# EAGLE design AST1035 (EAGLE 6.3)
DATABASE: ./../../../../../Components/TinyCircuits_Part_Database.txt
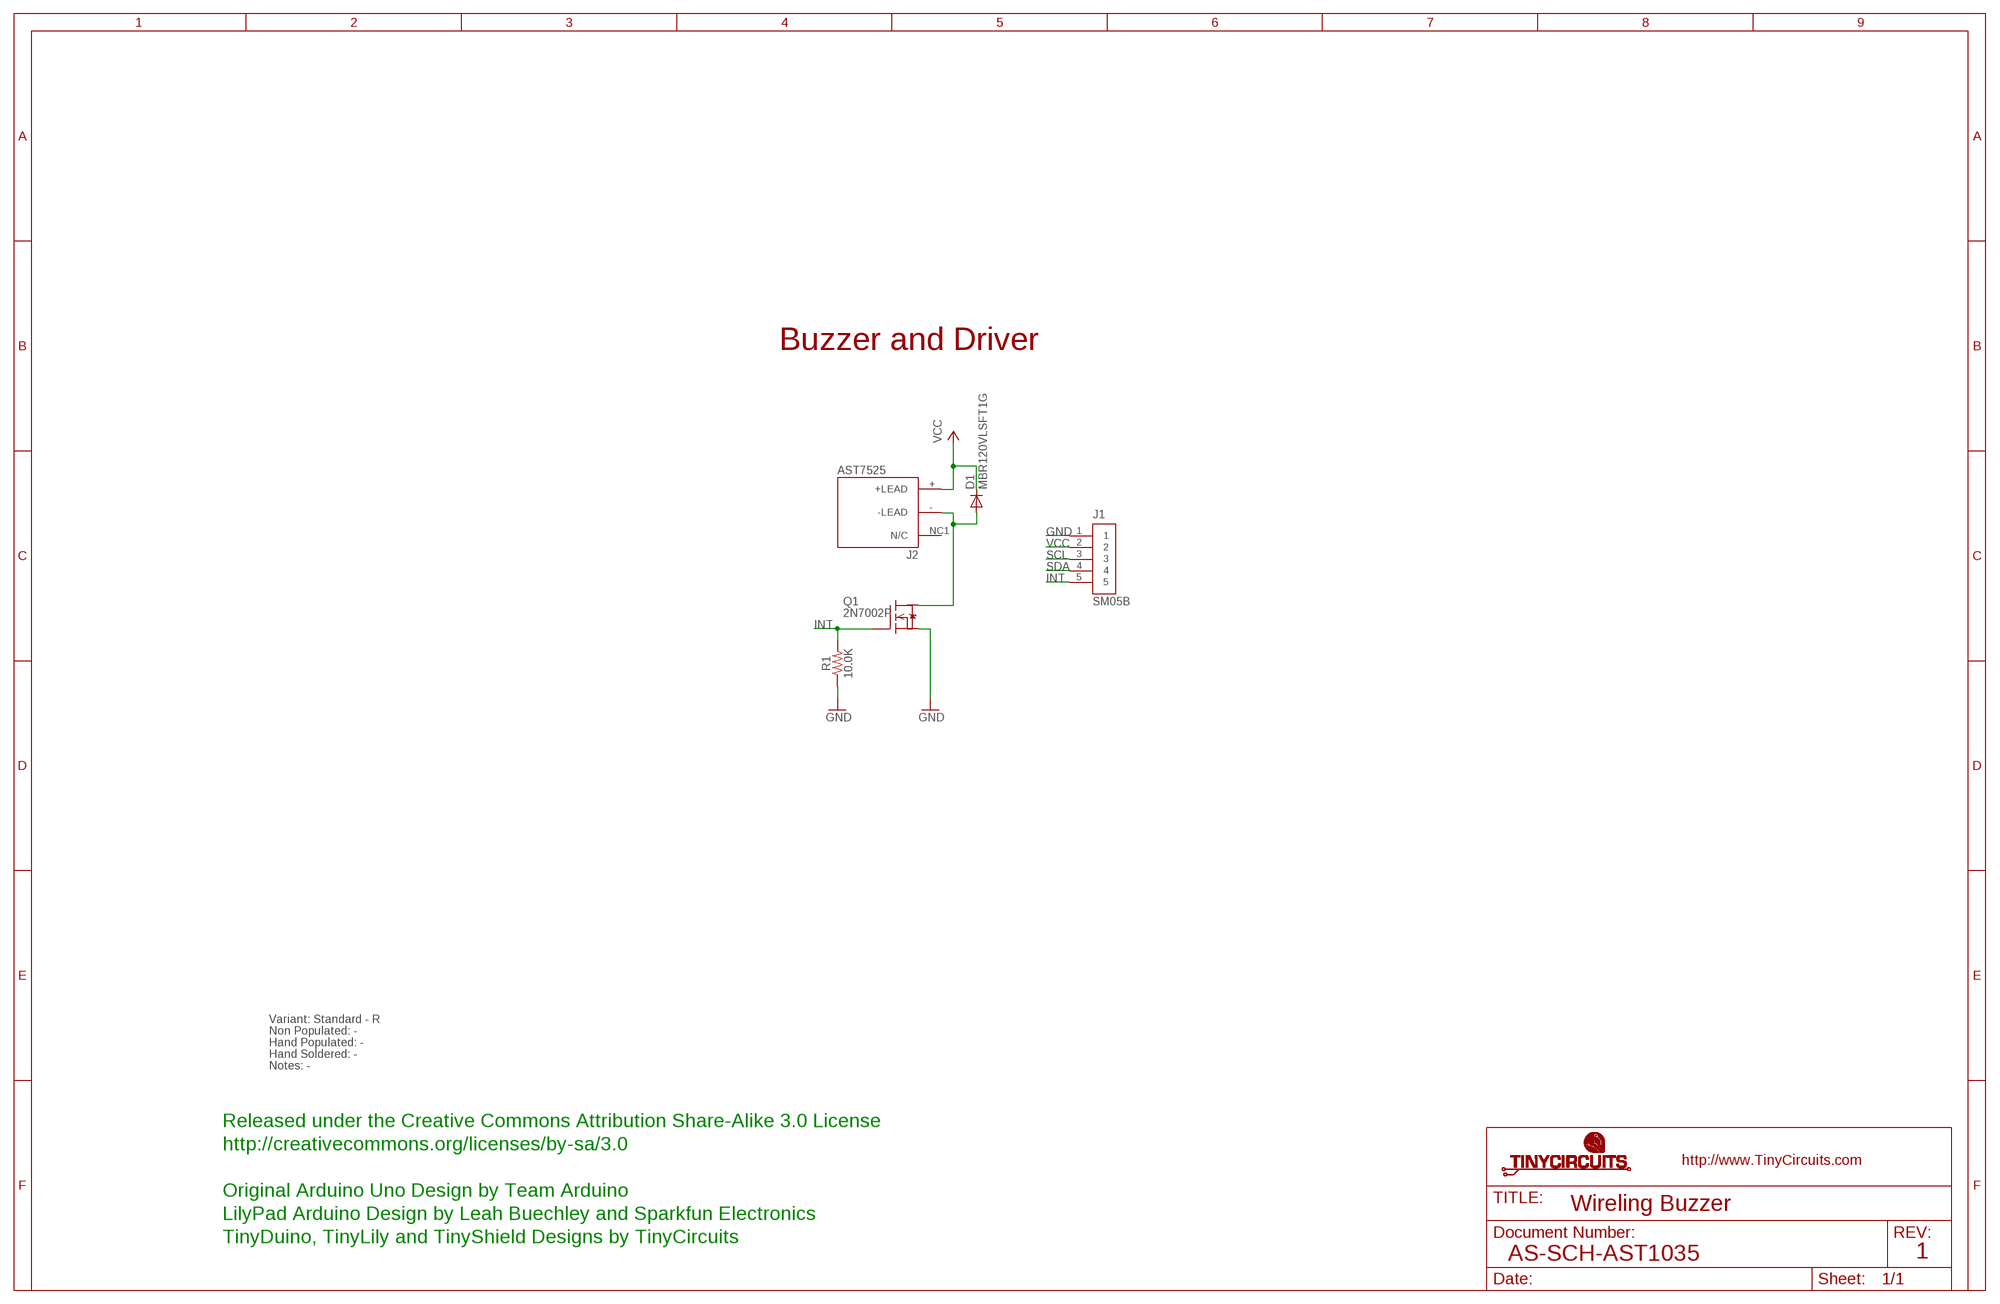
[diagram p0: schematic, sheet 1]

## Parts
D1  MBR120VLSFT1G  AS-ITM-00111  [SOD-123FL]
J1  SM05B  AS-ITM-00340EDGE  [JST_SH_5X1_EDGE]
J2  AST7525  AS-ITM-00390  [AST7525]
Q1  2N7002P  AS-ITM-00007C  [SOT23A]
R1  10.0K  AS-ITM-00032  [0402]

## Nets
GND: J1.1 Q1.E(S) R1.1
INT: J1.5 Q1.B(G) R1.2
LOAD: D1.A J2.-(-LEAD) Q1.C(D)
SCL: J1.3
SDA: J1.4
VCC: D1.C J1.2 J2.+(+LEAD)
Unconnected: J2.NC1(N/C)

## Notes on the sheet
- Buzzer and Driver
- Variant: Standard - R
- Non Populated: -
- Hand Populated: -
- Hand Soldered: -
- Notes: -
- Released under the Creative Commons Attribution Share-Alike 3.0 License
- http://creativecommons.org/licenses/by-sa/3.0
- Original Arduino Uno Design by Team Arduino
- Wireling Buzzer
- LilyPad Arduino Design by Leah Buechley and Sparkfun Electronics
- TinyDuino, TinyLily and TinyShield Designs by TinyCircuits
- AS-SCH-AST1035 | 1

## Library data of the parts
D1 = tinycircuits:AS-ITM-00111: DIODE SCHOTTKY 20V 1A SOD123L; PARTNO: AS-ITM-00111; PNPROTATION: 0
J1 = tinycircuits:AS-ITM-00340: CONN HEADER SH 5POS SIDE 1MM TIN; PARTNO: AS-ITM-00340; PNPROTATION: 180
J2 = tinycircuits:AS-ITM-00390: AUDIO MAGNETIC XDCR 2.5-4.5V SMD; PARTNO: AS-ITM-00390
Q1 = tinycircuits:AS-ITM-00007: MOSFET N-CH SGL 60V SOT-23; PARTNO: AS-ITM-00007; PNPROTATION: 0
R1 = tinycircuits:AS-ITM-00032: RES 10.0K OHM 1/16W 1% 0402 SMD; PARTNO: AS-ITM-00032

## Net classes
2 gnd: width 0.305 mm, drill 0.559 mm, clearance 0.254 mm

## Board
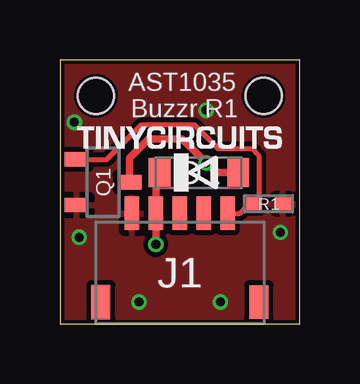
[diagram p1: board, top side]
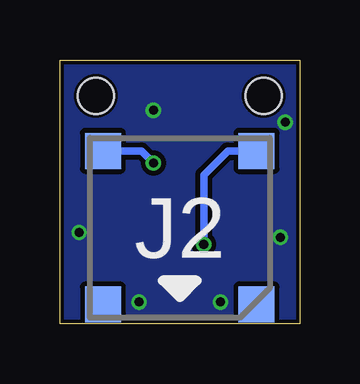
[diagram p2: board, bottom side, seen from below]

Size 10 x 11 mm. Coordinates in mm from the lower left corner, seen from the top.
Outline: 0,0 10,0 10,11 0,11 0,0
Copper layers (1*16): Top 0.035mm / dielectric 1.5mm / Bottom 0.035mm
Design rules "default *": minimum track width 8mil, minimum drill 15mil, track to track 8mil, track to pad 8mil, pad to pad 8mil, via to via 8mil, smd to smd 8mil, copper to edge 6mil, drill to drill 8mil, minimum pad ring 8mil, minimum via ring 5mil, stop-mask expansion 4mil, vias tented up to drill 25mil, thermal gap 10mil
Holes 1.5 mm at 1.5,9.5 8.5,9.5

### Footprints (pad centres in the part's own frame; a part is rotated, then mirrored left to right if it is on the bottom)
SOD-123FL = smd 0.914 x 1.219: A 1.638,0; C -1.638,0
JST_SH_5X1_EDGE = smd 0.6 x 1.4: 1 -2,2.475; 2 -1,2.475; 3 0,2.475; 4 1,2.475; 5 2,2.475 | smd 0.8 x 1.4: PAD1 -3.3,-1.225; PAD2 3.3,-1.225
AST7525 = smd 1.5 x 1.5: + 3.2,3.2; - -3.2,3.2; NC1 -3.2,-3.2; NC2 3.2,-3.2
SOT23A = smd 0.6 x 1: B -0.95,-1.1; C 0,1.1; E 0.95,-1.1
0402 = smd 0.65 x 0.55: 1 -0.6,0; 2 0.6,0

### Placement (x,y rotation side)
D1  5.8,6.3 0 top
J1  5,2.12 0 top
J2  5,4 0 bottom
Q1  1.8,5.9 270 top
R1  8.7,5 180 top
U$1  [DOCFIELD-TINYCIRCUITS-PCB]  19,-10 0 top  (outside the outline)

### Tracks (layer width: path | path; a pad name or v marks a point on that pad's centre or on a via)
GND  (via drill 0.38)
  other vias: 6.7,0.9 3.3,0.9 0.8,3.6 9.2,3.8 6.1,8.9 0.6,8.4
  pour Bottom: 0,11 10,11 10,0 0,0
  pour Top: 0,11 10,11 10,0 0,0
INT
  Top 0.203: J1.5 7.5,4.6 7.9,5 R1.2 8.3,5.2 8.3,7 8,7.3 6.6,7.3 5.6,8.3 3.4,8.3 1.95,6.85 Q1.B
LOAD  (via drill 0.38)
  Top 0.305: Q1.C 2.9,6.9 3.7,7.7 5.1,7.7 5.75,7.05 v6.1,6.7 6.5,6.3 D1.A
  Bottom 0.305: J2.- 6.6,7.2 v6.1,6.7
VCC  (via drill 0.38)
  Top 0.305: v4,3.3 J1.2 4,6.14 D1.C
  Bottom 0.305: v4,3.3 4,6.2 3,7.2 J2.+

### Text on the board
tPlace: AST1035 | Buzzr R1
Document: FABRICATION DRAWING | NOTES: | 1. PRINTED CIRCUIT BOARD MADE FROM NEMA GRADE FR-4 EPOXY LAMINATE | WITH 1 OUNCE COPPER PLATING AND .024 THICKNESS. | 2. ALL DIMENSIONS ARE GIVEN IN MILLIMETERS. | 3. CIRCUIT PATHS ARE FOR REFERENCE ONLY. | 4. HOLE SIZES SHOWN ARE FINISHED DIAMETERS AFTER PLATING. | 5. BOARD PLATED USING REFLOW OR SIMILAR METHOD. | 6. BOARD TO HAVE BLUE SOLDER MASK ON PLATED SURFACES USING WET FILM | 7. SILKSCREEN BOARD USING WHITE INK. | SR100 OR SR1010 EPOXY. EQUIVALENT WET OR DRY FILM MAY BE USED. | 8. THE FOLLOWING INFORMATION APPLIES TO THIS BOARD: | * 2 COPPER LAYERS | * .024 BOARD THICKNESS | * REQUIRES TOP SIDE SILKSCREEN | Released under the Creative Commons Attribution Share-Alike 3.0 License | http://creativecommons.org/licenses/by-sa/3.0 | Original Arduino Uno Design by Team Arduino | LilyPad Arduino Design by Leah Buechley and Sparkfun Electronics | TinyDuino, TinyLily and TinyShield Designs by TinyCircuits | Wireling Buzzer | AS-PCB-AST1035 | 1